# EAGLE design xmas_tree_pcb_B (EAGLE 6.3)
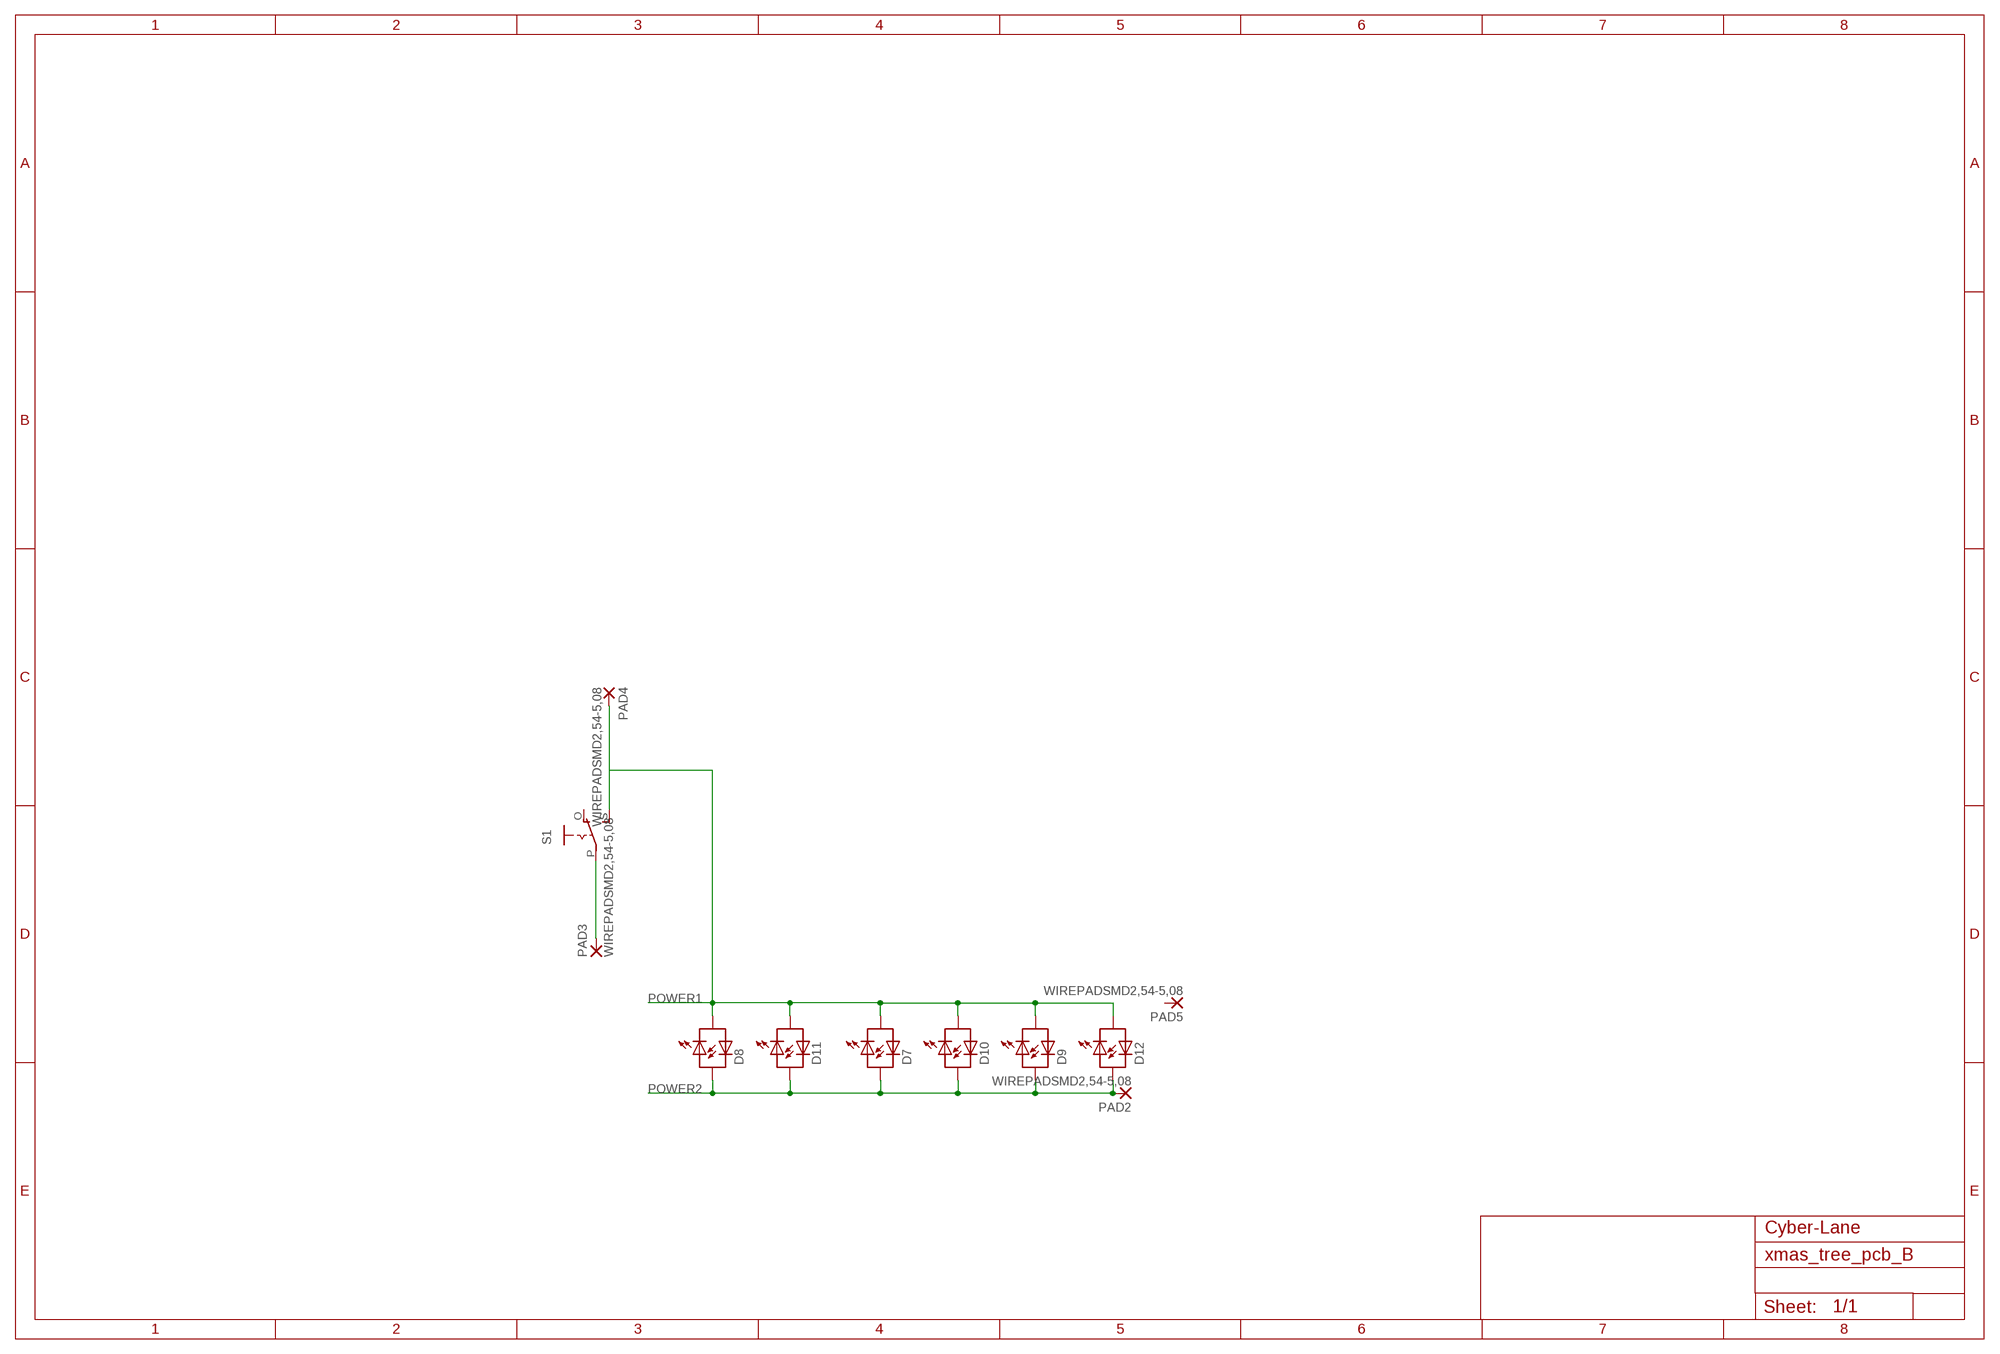
[diagram p0: schematic, sheet 1]

## Parts
D7  LED_BI_COLOR  [LED3MM]
D8  LED_BI_COLOR  [LED3MM]
D9  LED_BI_COLOR  [LED3MM]
D10  LED_BI_COLOR  [LED3MM]
D11  LED_BI_COLOR  [LED3MM]
D12  LED_BI_COLOR  [LED3MM]
PAD2  WIREPADSMD2,54-5,08  [SMD2,54-5,08]
PAD3  WIREPADSMD2,54-5,08  [SMD2,54-5,08]
PAD4  WIREPADSMD2,54-5,08  [SMD2,54-5,08]
PAD5  WIREPADSMD2,54-5,08  [SMD2,54-5,08]
S1  EG1218S  [EG1218]

## Nets
POWER1: D7.K(C1) D8.K(C1) D9.K(C1) D10.K(C1) D11.K(C1) D12.K(C1) PAD4.1(P) S1.S
POWER2: D7.A(A1) D8.A(A1) D9.A(A1) D10.A(A1) D11.A(A1) D12.A(A1) PAD2.1(P)
V+: PAD3.1(P) S1.P
Unconnected: PAD5.1(P) S1.O

## Notes on the sheet
- Cyber-Lane

## Library data of the parts
D7-D12 = SparkFun_mod:LED_BI_COLOR
PAD2-PAD5 = wirepad:WIREPAD: Wire PAD connect wire on PCB
S1 = adafruit:EG1218: SLIDING SWITCH 0.1" spacing through hole, vertical SPDT slide switch http://www.ladyada.net/library/pcb/eaglelibrary.html

## Board
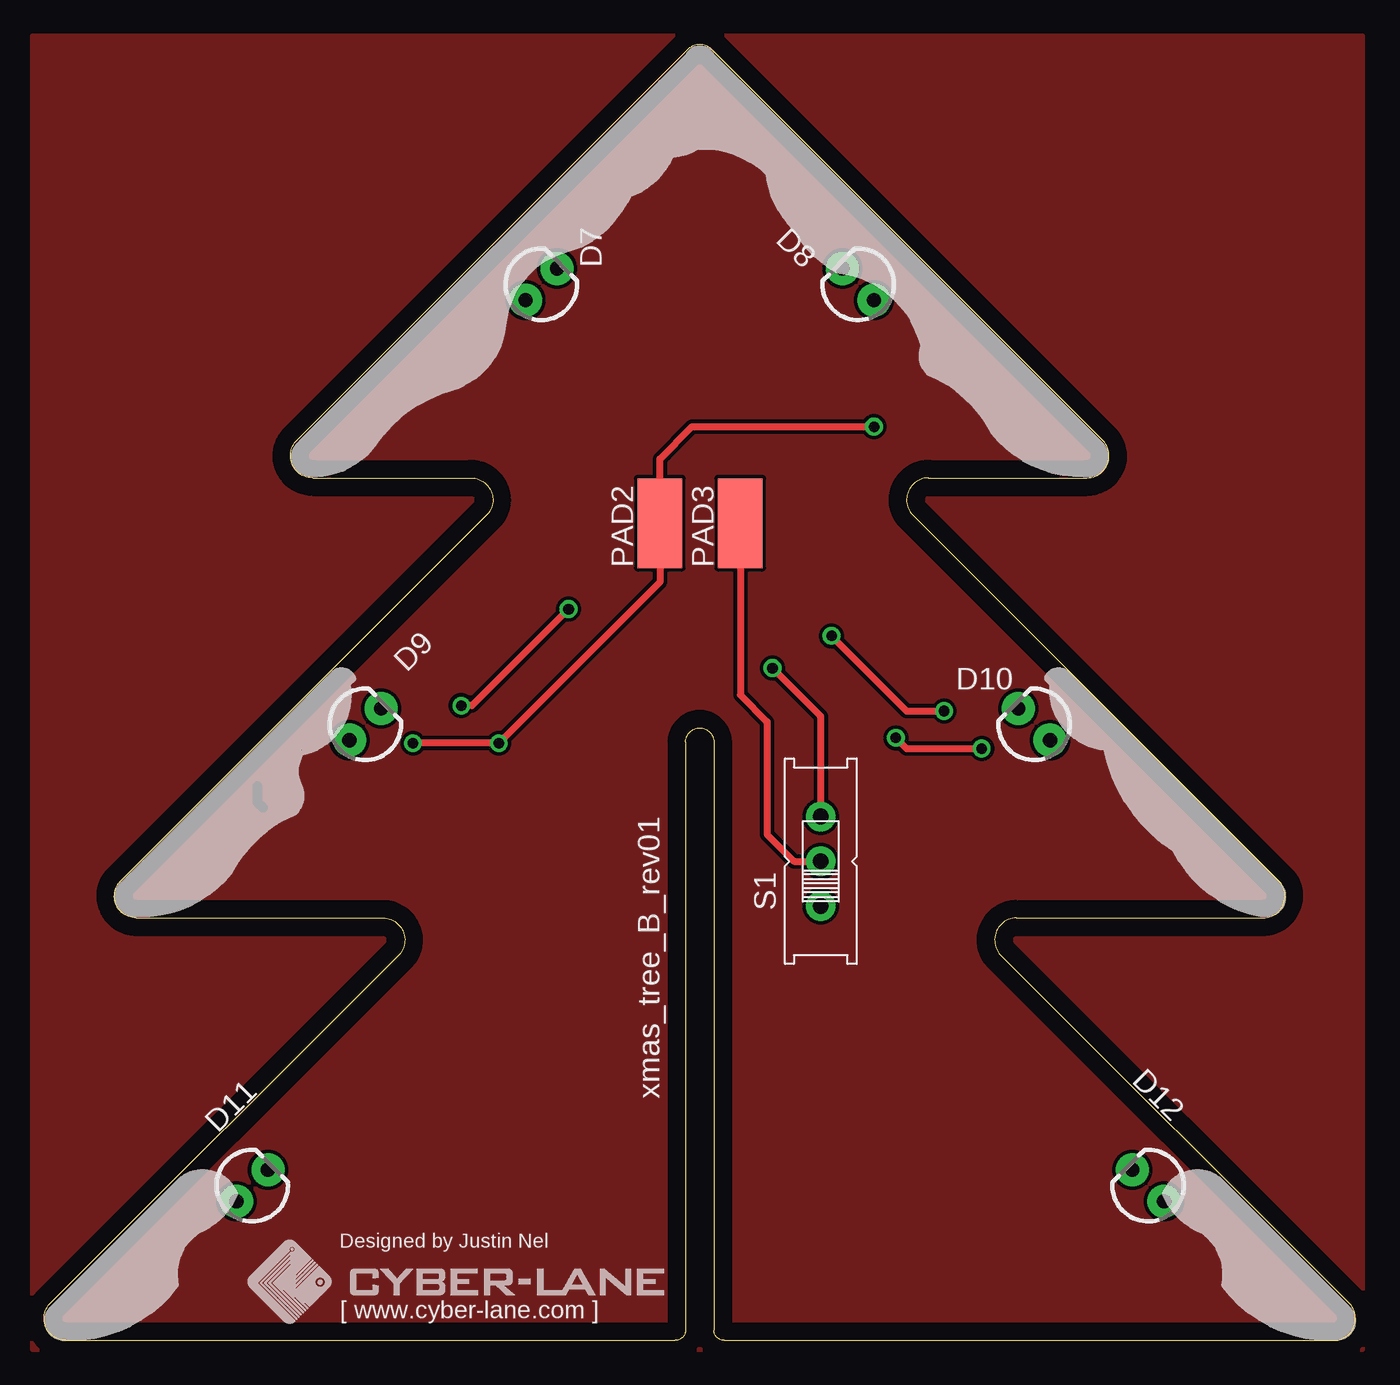
[diagram p1: board, top side]
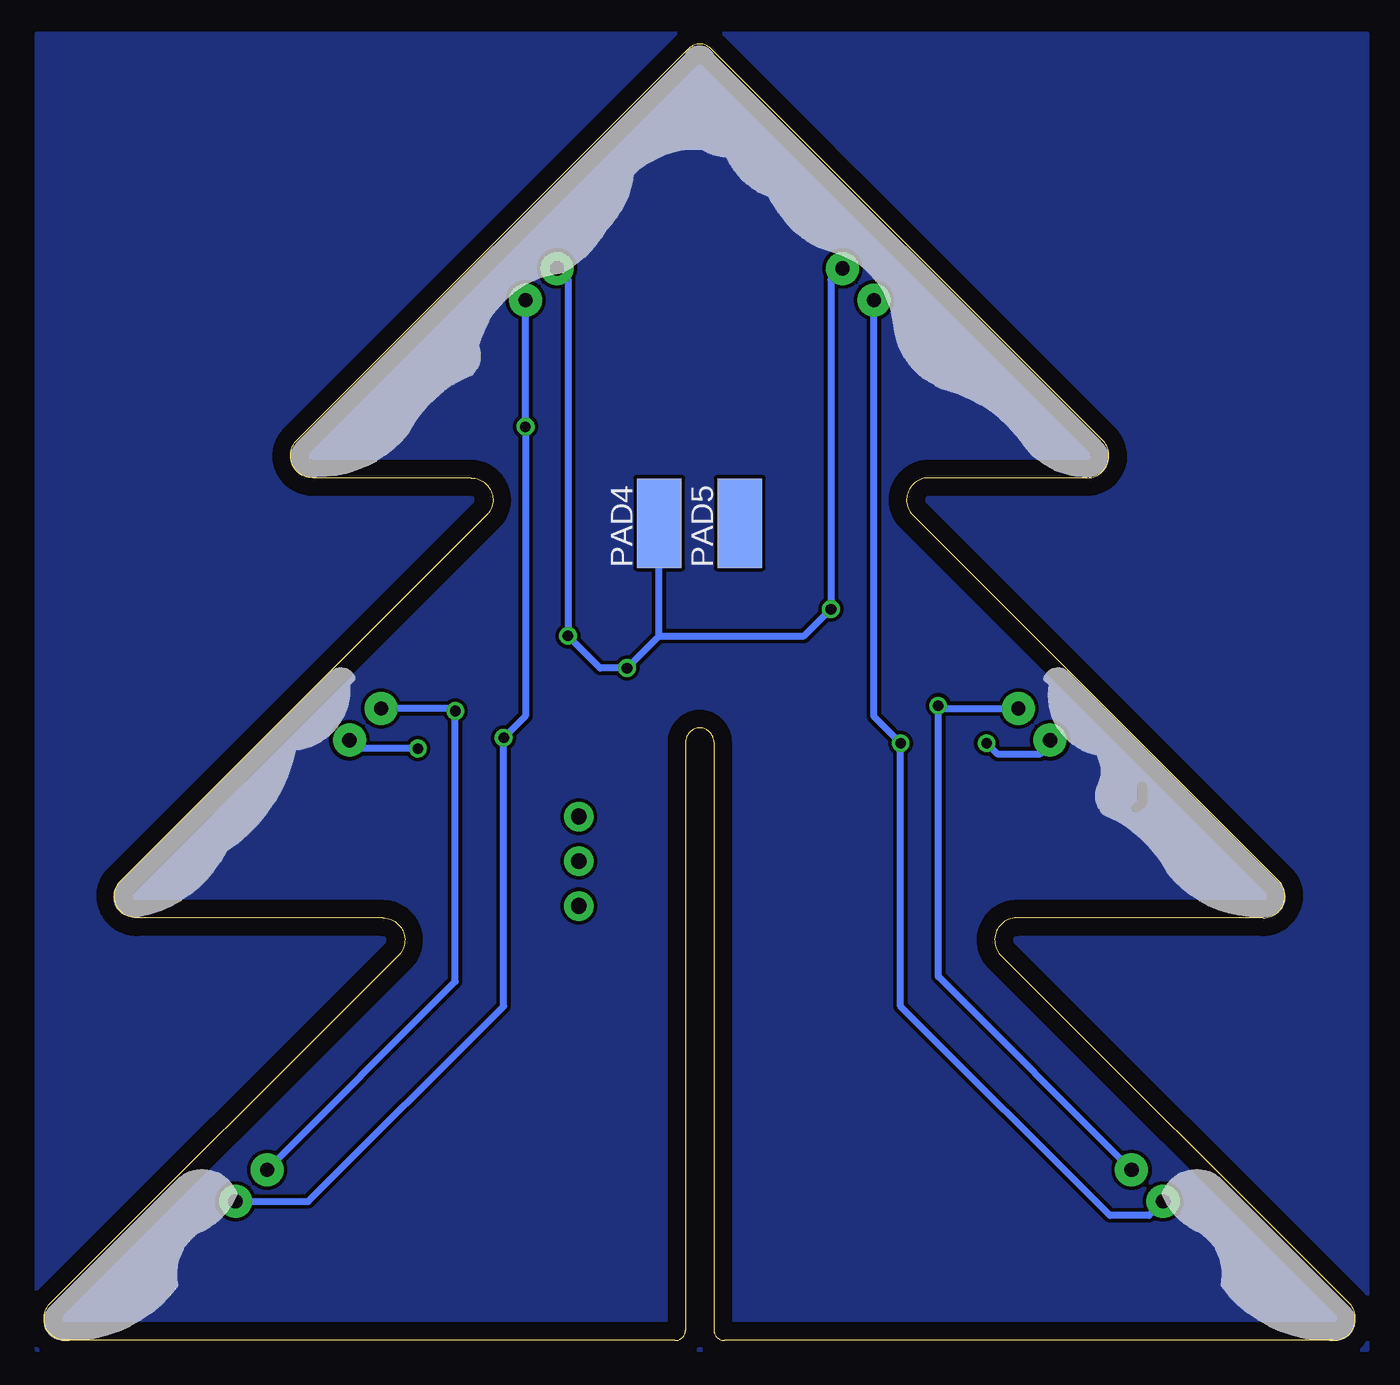
[diagram p2: board, bottom side, seen from below]

Size 74.5 x 73.65 mm. Coordinates in mm from the lower left corner, seen from the top.
Outline: 55.25,24 69.25,24 arc127 70.25,26 49.25,47 arc-127 50.25,49 59.25,49 arc127 60.25,51 37.85,73.4 arc90 36.65,73.4 14.25,51 arc127 15.25,49 24.25,49 arc-127 25.25,47 4.25,26 arc127 5.25,24 19.25,24 arc-127 20.25,22 0.25,2 arc127 1.25,0 35.85,0 arc90 36.45,0.59 36.45,34 arc-180 38.05,34 38.05,0.59 arc90 38.65,0 73.25,0 arc127 74.25,2 54.25,22 arc-127 55.25,24
Copper layers (1*16): Top 0.035mm / dielectric 1.5mm / Bottom 0.035mm
Design rules "default": minimum track width 10mil, minimum drill 20mil, track to track 8mil, track to pad 8mil, pad to pad 6mil, via to via 8mil, smd to smd 6mil, copper to edge 40mil, drill to drill 8mil, minimum pad ring 10mil, minimum via ring 8mil, stop-mask expansion 4mil, vias tented up to drill 20mil, thermal gap 10mil
tRestrict: 2 lines
bRestrict: 2 lines

### Footprints (pad centres in the part's own frame; a part is rotated, then mirrored left to right if it is on the bottom)
LED3MM = drill 0.813 pad 1.88: A -1.27,0; K 1.27,0
SMD2,54-5,08 = smd 2.54 x 5.08: 1 0,0
EG1218 = drill 0.9 pad 1.676: O -2.54,0; P 0,0; S 2.54,0

### Placement (x,y rotation side)
D7  28.25,60 45 top
D8  46.25,60 135 top
D9  18.25,35 45 top
D10  56.25,35 135 top
D11  11.83,8.8 45 top
D12  62.72,8.8 135 top
PAD2  34.98,46.43 0 top
PAD3  39.55,46.43 0 top
PAD4  39.55,46.43 0 bottom
PAD5  34.98,46.43 0 bottom
S1  44.12,27.22 90 top

### Tracks (layer width: path | path; a pad name or v marks a point on that pad's centre or on a via)
GND
  pour Top (isolate 0.152): -0.68,-0.51 -0.68,74.11 74.91,74.11 74.91,-0.51
  pour Bottom (isolate 0.152): -0.68,-0.51 74.91,-0.51 74.91,74.23 -0.68,74.23
POWER1  (via drill 0.6)
  Top 0.406: v29.8,41.55 24.31,36.06 v23.7,36.06 | v44.73,40.02 49,35.76 v51.13,35.76 | S1.S 44.12,35.45 v41.38,38.2
  Bottom 0.406: D11.K 23.7,20.68 v23.7,36.06 23.54,35.9 D9.K | D7.K 29.8,60.25 v29.8,41.55 31.32,40.02 39.55,40.02 | D12.K 51.13,20.39 v51.13,35.76 51.27,35.9 D10.K | D8.K 44.73,60.28 v44.73,40.02 42.9,38.2 v41.38,38.2 39.55,40.02 | 39.55,40.02 PAD4.1
POWER2  (via drill 0.6)
  Top 0.406: v20.96,33.93 v25.84,33.93 34.98,43.07 PAD2.1 34.98,50.08 36.81,51.91 v47.15,51.91 | v48.39,34.23 49,33.62 v53.27,33.62
  Bottom 0.406: D11.A 11.72,7.11 13.95,7.11 25.84,18.99 v25.84,33.93 27.35,35.44 D7.A | v20.96,33.93 20.35,33.32 17.91,33.32 17.35,33.88 D9.A | D12.A 59.48,7.9 48.39,18.99 v48.39,34.23 47.15,35.48 v47.15,51.91 D8.A | v53.27,33.62 56.67,33.62 D10.A
V+
  Top 0.406: PAD3.1 39.55,36.67 41.08,35.15 41.08,28.75 42.6,27.22 S1.P

### Text on the board
tPlace: xmas_tree_B_rev01 | Designed by Justin Nel | [ www.cyber-lane.com ]